# EAGLE design attenumixer (EAGLE 7.7.0)
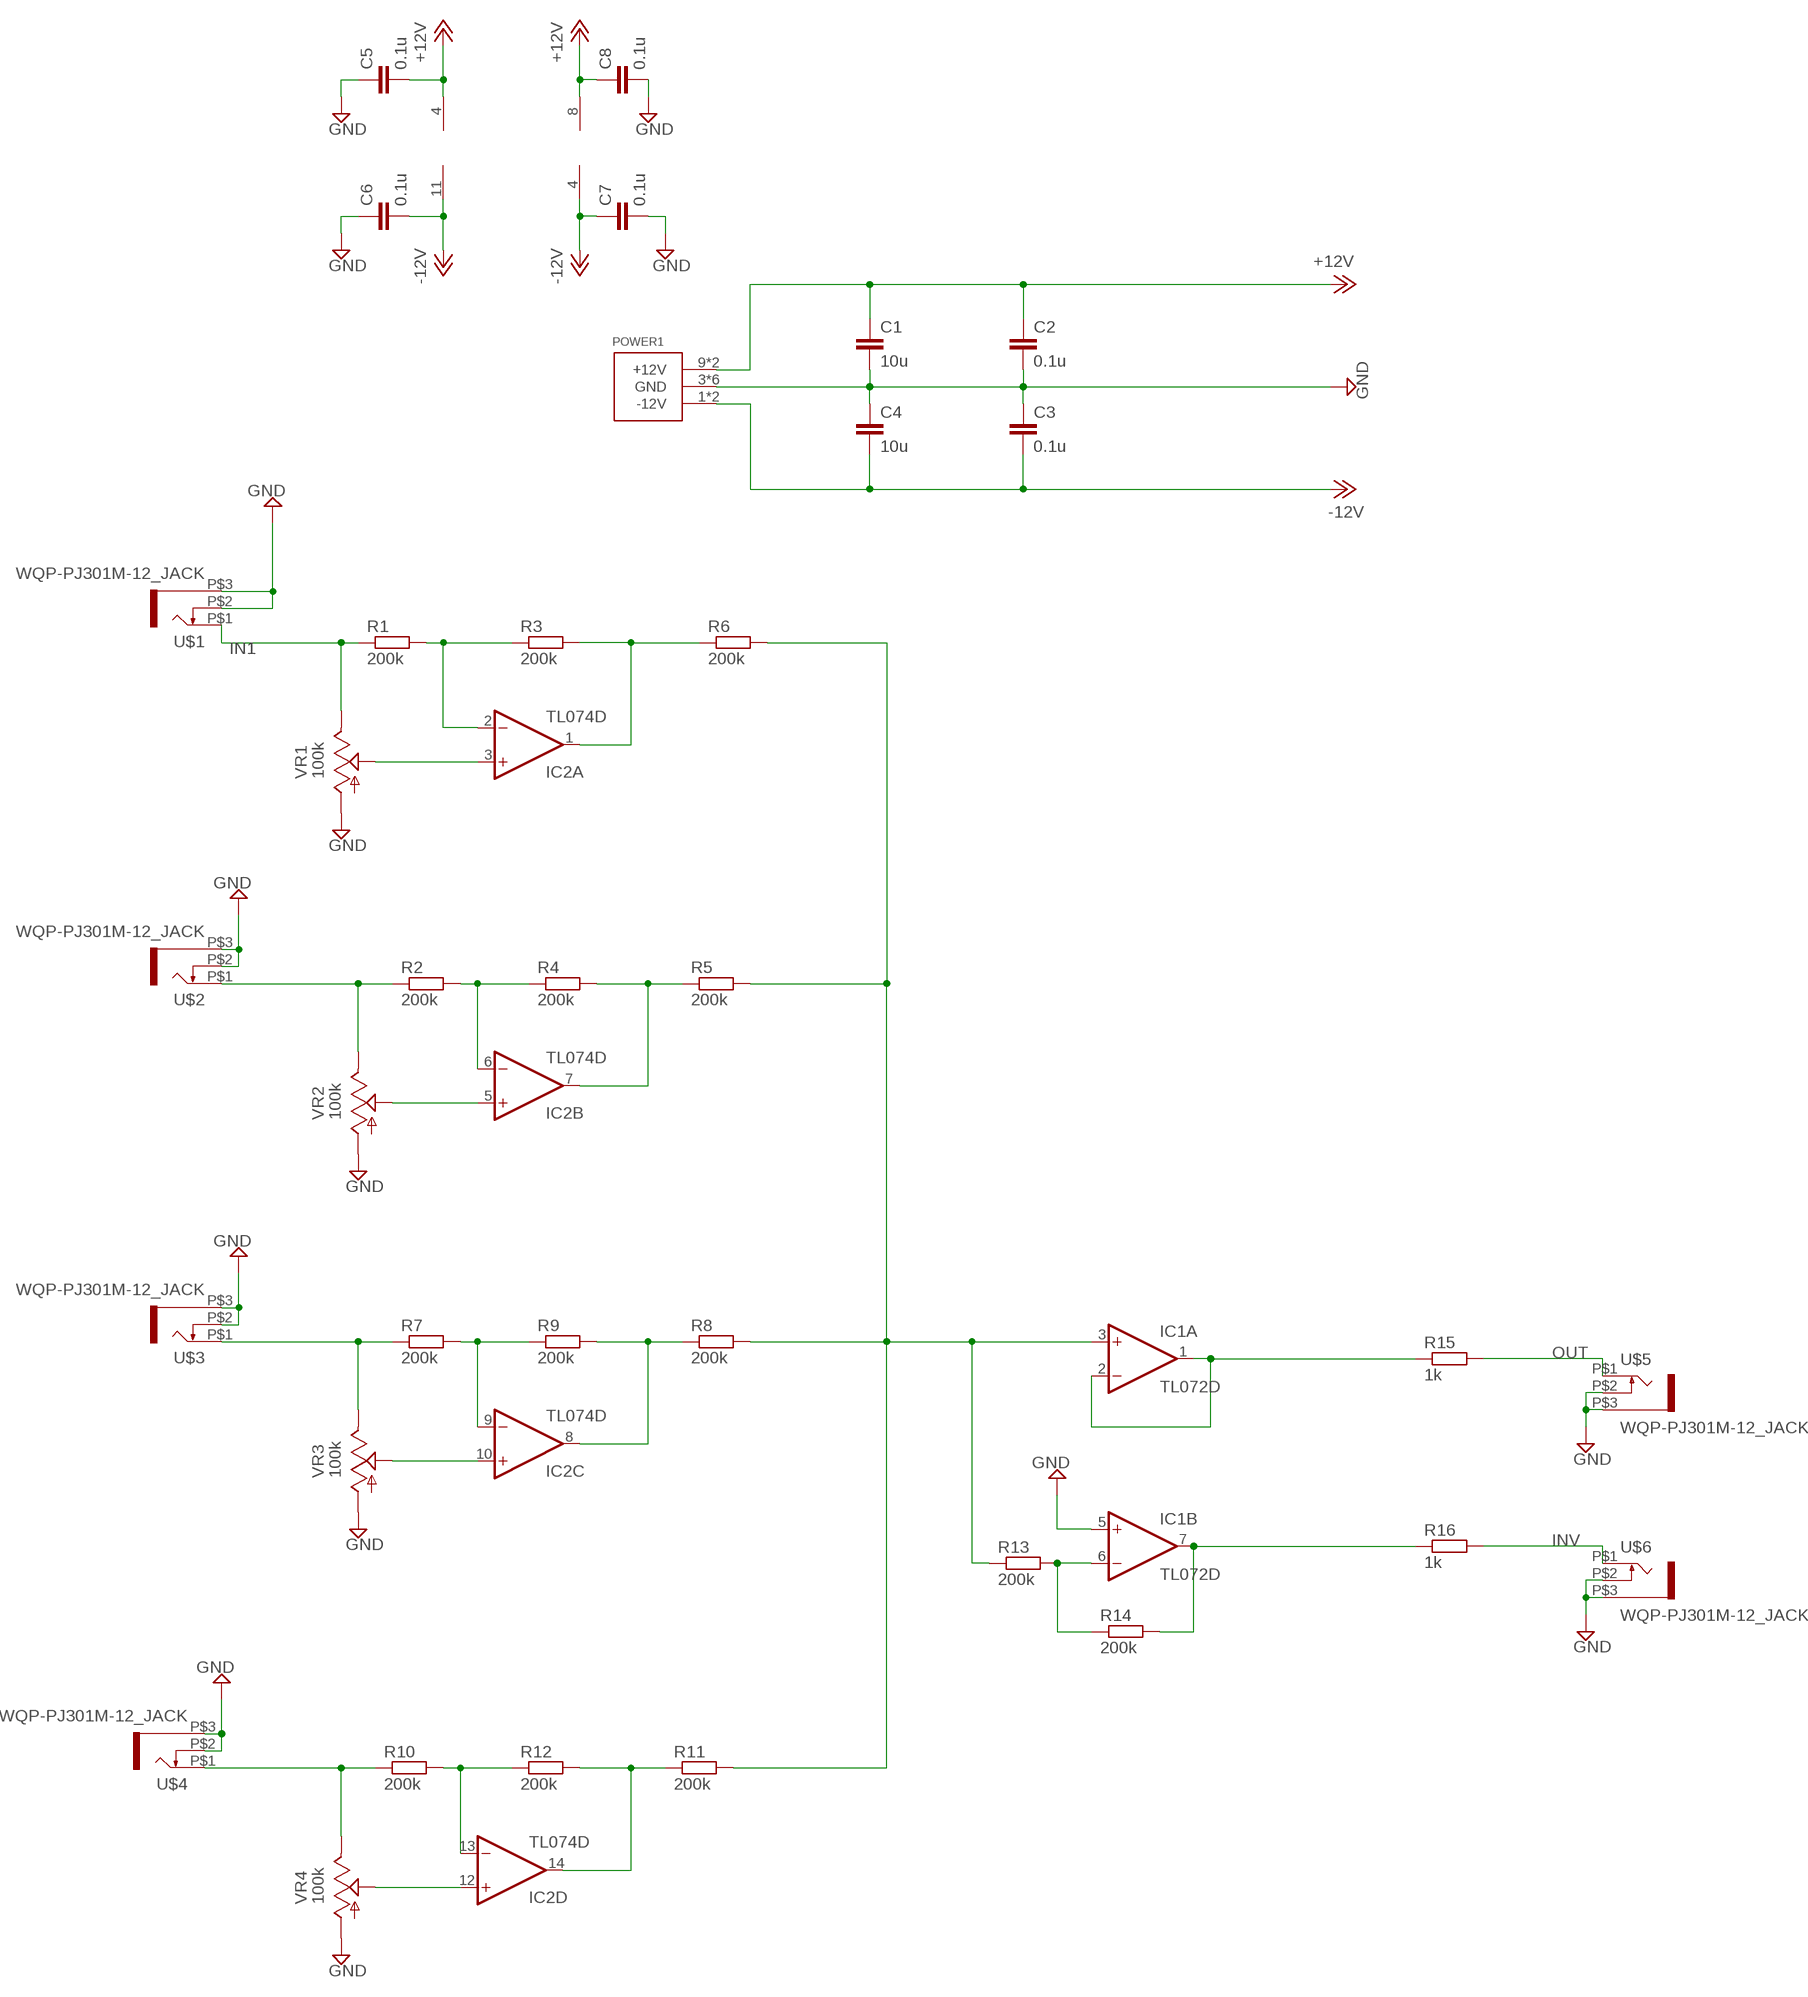
[diagram p0: schematic, sheet 1]

## Parts
C1  10u  C-EUC0805  [C0805]
C2  0.1u  C-EUC0805  [C0805]
C3  0.1u  C-EUC0805  [C0805]
C4  10u  C-EUC0805  [C0805]
C5  0.1u  C-EUC0805  [C0805]
C6  0.1u  C-EUC0805  [C0805]
C7  0.1u  C-EUC0805  [C0805]
C8  0.1u  C-EUC0805  [C0805]
IC1  TL072D  [SO08]
IC2  TL074D  [SO14]
POWER1  POWER_SIMPLE10  [POWER_10]
R1  200k  R-EU_R0805  [R0805]
R2  200k  R-EU_R0805  [R0805]
R3  200k  R-EU_R0805  [R0805]
R4  200k  R-EU_R0805  [R0805]
R5  200k  R-EU_R0805  [R0805]
R6  200k  R-EU_R0805  [R0805]
R7  200k  R-EU_R0805  [R0805]
R8  200k  R-EU_R0805  [R0805]
R9  200k  R-EU_R0805  [R0805]
R10  200k  R-EU_R0805  [R0805]
R11  200k  R-EU_R0805  [R0805]
R12  200k  R-EU_R0805  [R0805]
R13  200k  R-EU_R0805  [R0805]
R14  200k  R-EU_R0805  [R0805]
R15  1k  R-EU_R0805  [R0805]
R16  1k  R-EU_R0805  [R0805]
U$1  WQP-PJ301M-12_JACK  [WQP-PJ301M-12_JACK]
U$2  WQP-PJ301M-12_JACK  [WQP-PJ301M-12_JACK]
U$3  WQP-PJ301M-12_JACK  [WQP-PJ301M-12_JACK]
U$4  WQP-PJ301M-12_JACK  [WQP-PJ301M-12_JACK]
U$5  WQP-PJ301M-12_JACK  [WQP-PJ301M-12_JACK]
U$6  WQP-PJ301M-12_JACK  [WQP-PJ301M-12_JACK]
VR1  100k  9MM_SNAP-IN_POT_  [9MM_SNAP-IN_POT]
VR2  100k  9MM_SNAP-IN_POT_  [9MM_SNAP-IN_POT]
VR3  100k  9MM_SNAP-IN_POT_  [9MM_SNAP-IN_POT]
VR4  100k  9MM_SNAP-IN_POT_  [9MM_SNAP-IN_POT]

## Nets
+12V: C1.1 C2.1 C5.2 C8.1 IC1.8(P:V+) IC2.4(P:V+) POWER1.9(+12V) POWER1.10(+12V)
-12V: C3.2 C4.2 C6.2 C7.1 IC1.4(P:V-) IC2.11(P:V-) POWER1.1(-12V) POWER1.2(-12V)
GND: C1.2 C2.2 C3.1 C4.1 C5.1 C6.1 C7.2 C8.2 IC1.5(B:+IN) POWER1.3(GND) POWER1.4(GND) POWER1.5(GND) POWER1.6(GND) POWER1.7(GND) POWER1.8(GND) U$1.P$2 U$1.P$3 U$2.P$2 U$2.P$3 U$3.P$2 U$3.P$3 U$4.P$2 U$4.P$3 U$5.P$2 U$5.P$3 U$6.P$2 U$6.P$3 VR1.1(A) VR2.1(A) VR3.1(A) VR4.1(A)
IN1: R1.1 U$1.P$1 VR1.3(E)
INV: R16.2 U$6.P$1
N$1: IC2.3(A:+IN) VR1.2(S)
N$2: IC2.5(B:+IN) VR2.2(S)
N$3: IC2.7(B:OUT) R4.2 R5.1
N$4: R2.1 U$2.P$1 VR2.3(E)
N$5: IC2.1(A:OUT) R3.2 R6.1
N$6: IC2.2(A:-IN) R1.2 R3.1
N$7: IC2.10(C:+IN) VR3.2(S)
N$8: IC2.6(B:-IN) R2.2 R4.1
N$9: IC1.1(A:OUT) IC1.2(A:-IN) R15.1
N$11: IC2.8(C:OUT) R8.1 R9.2
N$12: R7.1 U$3.P$1 VR3.3(E)
N$13: IC2.9(C:-IN) R7.2 R9.1
N$14: IC1.7(B:OUT) R14.2 R16.1
N$15: IC2.12(D:+IN) VR4.2(S)
N$16: IC2.14(D:OUT) R11.1 R12.2
N$17: R10.1 U$4.P$1 VR4.3(E)
N$18: IC2.13(D:-IN) R10.2 R12.1
N$19: IC1.3(A:+IN) R5.2 R6.2 R8.2 R11.2 R13.1
N$20: IC1.6(B:-IN) R13.2 R14.1
OUT: R15.2 U$5.P$1

## Library data of the parts
C1-C8 = rcl:C-EU: CAPACITOR, European symbol
IC1 = linear:TL072: OP AMP
IC2 = linear:TL074: OP AMP
POWER1 = eurorack:POWER_SIMPLE
R1-R16 = rcl:R-EU_: RESISTOR, European symbol
U$1-U$6 = thonkiconn:WQP-PJ301M-12_JACK
VR1-VR4 = MusicThingModular:9MM_SNAP-IN_POT: 9mm vertical snap-in pot, Alpha / Panasonic style

## Board
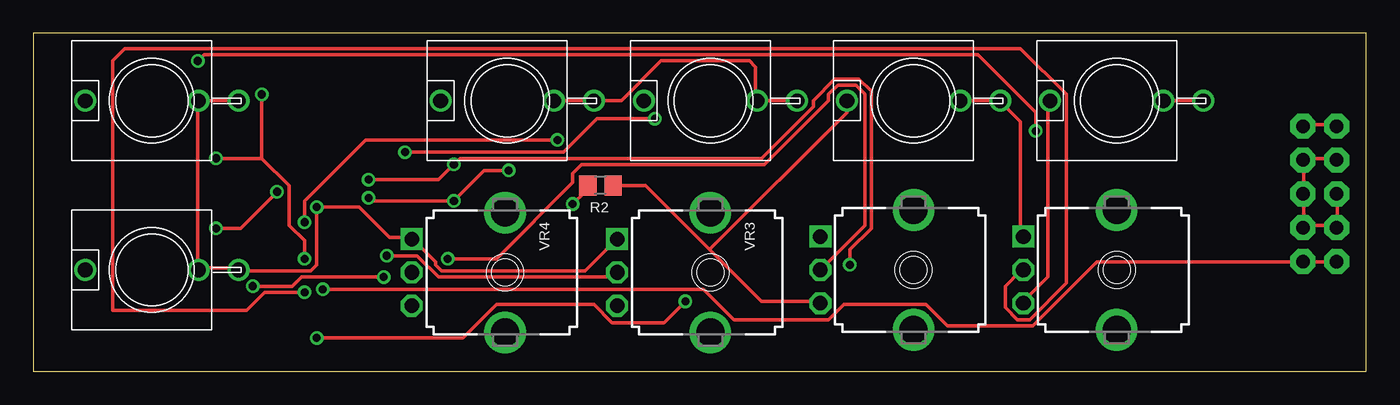
[diagram p1: board, top side]
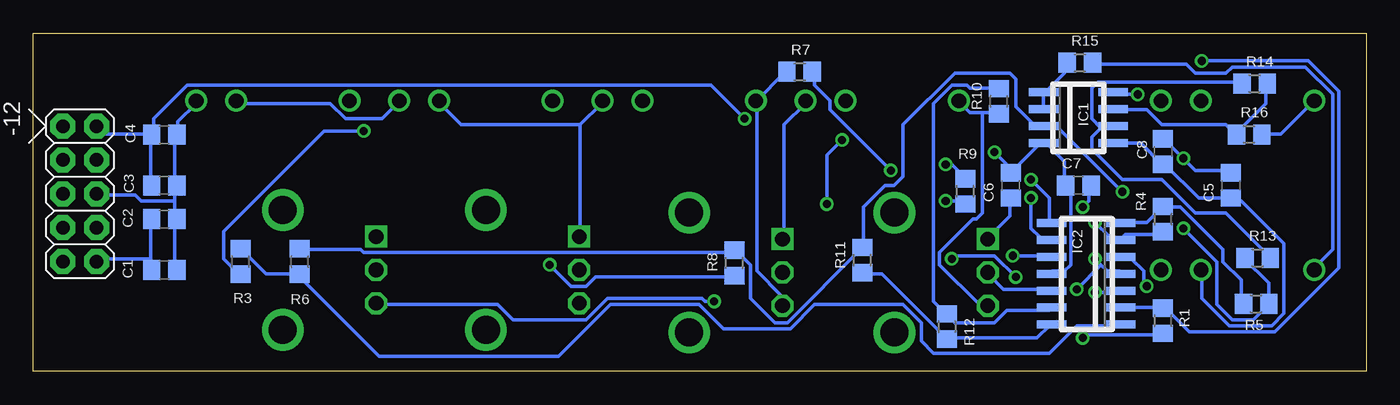
[diagram p2: board, bottom side, seen from below]

Size 100 x 25.39 mm. Coordinates in mm from the lower left corner, seen from the top.
Outline: 0,0 100,0 100,25.39 0,25.39 0,0
Copper layers (1*16): Top 0.035mm / dielectric 1.5mm / Bottom 0.035mm
Design rules "default": minimum track width 10mil, minimum drill 24mil, track to track 8mil, track to pad 8mil, pad to pad 8mil, via to via 8mil, smd to smd 8mil, copper to edge 40mil, drill to drill 8mil, minimum pad ring 10mil, minimum via ring 8mil, stop-mask expansion 4mil, vias tented up to drill 0mil, thermal gap 10mil

### Footprints (pad centres in the part's own frame; a part is rotated, then mirrored left to right if it is on the bottom)
C0805 = smd 1.3 x 1.5: 1 -0.95,0; 2 0.95,0
SO08 = smd 0.6 x 2.2: 1 -1.905,-2.6; 2 -0.635,-2.6; 3 0.635,-2.6; 4 1.905,-2.6; 5 1.905,2.6; 6 0.635,2.6; 7 -0.635,2.6; 8 -1.905,2.6
SO14 = smd 0.6 x 2.2: 1 -3.81,-2.6; 2 -2.54,-2.6; 3 -1.27,-2.6; 4 0,-2.6; 5 1.27,-2.6; 6 2.54,-2.6; 7 3.81,-2.6; 8 3.81,2.6; 9 2.54,2.6; 10 1.27,2.6; 11 0,2.6; 12 -1.27,2.6; 13 -2.54,2.6; 14 -3.81,2.6
POWER_10 = drill 1.016 pad 1.88 octagon: 1 -5.08,-1.27; 2 -5.08,1.27; 3 -2.54,-1.27; 4 -2.54,1.27; 5 0,-1.27; 6 0,1.27; 7 2.54,-1.27; 8 2.54,1.27; 9 5.08,-1.27; 10 5.08,1.27
R0805 = smd 1.3 x 1.5: 1 -0.95,0; 2 0.95,0
WQP-PJ301M-12_JACK = drill 1.1: P$1 0,5; P$2 0,-3.5; P$3 0,-6.5
9MM_SNAP-IN_POT = drill 1.1 square: 1 -2.5,-7 | drill 1.1 octagon: 2 0,-7; 3 2.5,-7 | drill 2.1 pad 2.794: CHASSIS1 -4.5,0; CHASSIS2 4.5,0

### Placement (x,y rotation side)
C1  90.17,7.62 0 bottom
C2  90.17,11.43 0 bottom
C3  90.17,13.97 180 bottom
C4  90.17,17.78 180 bottom
C5  10.16,13.97 90 bottom
C6  26.67,13.97 90 bottom
C7  21.59,13.97 0 bottom
C8  15.24,16.51 270 bottom
IC1  21.59,19.05 270 bottom
IC2  21.01,7.33 90 bottom
POWER1  96.52,13.34 270 bottom
R1  15.24,3.81 90 bottom
R2  42.55,13.97 180 top
R3  84.45,8.26 90 bottom
R4  15.24,11.43 90 bottom
R5  8.26,5.08 0 bottom
R6  80.01,8.26 90 bottom
R7  42.51,22.5 0 bottom
R8  47.4,8.15 90 bottom
R9  30.07,13.53 90 bottom
R10  27.55,20.28 90 bottom
R11  37.81,8.36 90 bottom
R12  31.46,3.37 270 bottom
R13  8.15,8.53 0 bottom
R14  8.36,21.61 0 bottom
R15  21.48,23.18 0 bottom
R16  8.78,17.8 0 bottom
U$1  81.28,20.32 90 top
U$2  66.04,20.32 90 top
U$3  50.8,20.32 90 top
U$4  35.56,20.32 90 top
U$5  8.89,7.62 90 top
U$6  8.89,20.32 90 top
VR1  81.28,7.62 270 top
VR2  66.04,7.62 270 top
VR3  50.8,7.43 270 top
VR4  35.39,7.43 270 top

### Tracks (layer width: path | path; a pad name or v marks a point on that pad's centre or on a via)
+12V  (via drill 0.61)
  Top 0.254: POWER1.9 97.61,8.23 95.33,8.23 POWER1.10 95.1,8.23 79.78,8.23 74.98,3.43 68.58,3.43 66.98,5.03 60.81,5.03 59.66,3.89 52.58,3.89 50.29,6.17 v21.72,6.17 | v20.34,8.46 20.34,9.83 19.2,10.97 19.2,13.95 17.14,16 | v13.72,16 17.14,16 | 17.14,16 v17.14,20.8
  Bottom 0.254: 91.21,8.46 91.21,11.43 C2.1 | 91.21,8.46 91.21,7.77 C1.1 | 91.21,8.46 95.1,8.46 POWER1.10 | C5.2 10.29,15.09 12.8,15.09 v13.72,16 15.09,17.37 C8.1 | v20.34,8.46 19.89,8 | 19.89,8 19.43,7.54 18.52,7.54 IC2.4 | v17.14,20.8 18.97,20.8 IC1.8 | 19.89,8 v21.72,6.17
-12V  (via drill 0.61)
  Top 0.254: POWER1.1 97.61,18.52 95.33,18.52 POWER1.2 | v46.63,18.97 42.29,18.97 39.78,16.46 v27.89,16.46
  Bottom 0.254: C3.2 91.21,14.17 91.21,17.6 C4.2 | C4.2 91.21,17.83 94.64,17.83 95.1,18.29 POWER1.2 | 26.52,15.09 24.46,17.14 IC1.4 24,17.14 22.63,15.77 22.63,14.17 C7.1 22.4,13.95 22.17,13.72 22.17,8 22.63,7.54 23.55,7.54 IC2.11 | v46.63,18.97 49.15,21.49 88.47,21.49 90.98,18.97 90.98,17.83 C4.2 | 26.52,15.09 v27.89,16.46 | 26.52,15.09 C6.2
GND  (via drill 0.61)
  Top 0.254: U$6.P$3 15.32,20.34 12.57,20.34 U$6.P$2 12.34,20.12 12.34,7.77 U$5.P$2 12.57,7.77 15.32,7.77 U$5.P$3 15.54,7.54 20.8,7.54 21.26,8 v21.26,12.34 24.46,12.34 26.75,10.06 28.35,10.06 VR4.1 28.57,9.83 30.18,8.23 30.18,8 30.63,7.54 41.38,7.54 43.66,9.83 VR3.1 | POWER1.3 97.61,16 95.33,16 POWER1.4 95.33,15.77 95.33,13.49 POWER1.6 95.33,13.26 95.33,10.97 | POWER1.5 97.84,13.26 97.84,10.97 POWER1.7 97.61,10.97 95.33,10.97 | 95.33,10.97 POWER1.8 | U$1.P$2 84.81,20.34 87.55,20.34 U$1.P$3 | U$4.P$2 39.09,20.34 41.83,20.34 U$4.P$3 42.06,20.34 44.12,20.34 47.09,23.32 53.72,23.32 54.18,22.86 54.18,20.34 U$3.P$2 54.41,20.34 57.15,20.34 U$3.P$3 | VR1.1 74.07,10.29 74.07,18.75 72.69,20.12 U$2.P$3 72.47,20.34 69.72,20.34 U$2.P$2
  Bottom 0.254: IC1.5 16.92,17.14 15.32,15.54 C8.2 15.09,15.54 12.57,13.03 10.29,13.03 C5.1 10.06,12.8 9.37,12.8 6.17,9.6 6.17,4.34 7.09,3.43 10.29,3.43 12.34,5.49 12.34,7.54 U$5.P$2 | v21.26,12.34 20.8,12.8 20.8,13.95 C7.2 | C6.1 26.75,12.8 26.75,11.66 28.35,10.06 VR4.1 | 89.38,11.43 89.38,7.77 C1.2 | 89.38,11.43 89.38,12.8 | 89.38,12.8 89.38,13.95 C3.1 89.38,14.17 89.38,17.6 C4.1 89.15,17.83 89.15,18.75 87.78,20.12 U$1.P$3 | 89.38,11.43 C2.2 | 89.38,12.8 91.9,12.8 92.35,13.26 95.1,13.26 POWER1.6 | VR3.1 43.66,10.06 43.66,18.52 42.06,20.12 U$4.P$3 | 58.98,18.52 58.98,10.29 VR2.1 | 58.98,18.52 57.38,20.12 U$3.P$3 | 58.98,18.52 67.89,18.52 69.49,20.12 U$2.P$2 | U$1.P$2 84.58,20.12 77.72,20.12 76.58,18.97 73.84,18.97 72.69,20.12 U$2.P$3
IN1  (via drill 0.61)
  Top 0.254: v21.26,2.52 32.23,2.52 34.75,5.03 42.06,5.03 43.43,3.66 47.32,3.66 v48.92,5.26 | U$1.P$1 76.12,20.12 76.12,7.09 74.3,5.26 VR1.3
  Bottom 0.254: v21.26,2.52 21.03,2.74 15.32,2.74 R1.1 | v48.92,5.26 49.61,5.26 49.84,5.49 56.92,5.49 58.52,3.89 64.01,3.89 65.15,5.03 74.07,5.03 VR1.3
INV
  Bottom 0.254: R16.2 7.77,17.83 6.4,17.83 4.12,20.12 U$6.P$1
N$1  (via drill 0.61)
  Top 0.254: v20.34,5.94 17.37,5.94 16,4.57 5.94,4.57 5.94,23.32 6.86,24.23 74.07,24.23 77.5,20.8 77.5,6.63 74.75,3.89 73.84,3.89 72.92,4.8 72.92,6.4 74.07,7.54 VR1.2
  Bottom 0.254: v20.34,5.94 18.52,5.94 IC2.3
N$2  (via drill 0.61)
  Top 0.254: v16.46,6.4 19.43,6.4 20.12,7.09 v26.29,7.09 | v31.09,8.46 34.75,8.46 40.46,14.17 40.46,14.86 41.15,15.54 54.86,15.54 59.66,20.34 59.66,20.8 60.35,21.49 61.72,21.49 62.41,20.8 62.41,10.97 59.21,7.77 VR2.2
  Bottom 0.254: v16.46,6.4 16.69,6.63 16.69,7.54 17.6,8.46 18.29,8.46 IC2.5 | v26.29,7.09 27.89,8.69 30.86,8.69 v31.09,8.46
N$3
  Bottom 0.254: R5.1 9.37,5.26 9.37,6.86 10.74,8.23 10.74,9.14 13.95,12.34 15.09,12.34 R4.2 15.32,12.34 16.46,11.2 18.29,11.2 IC2.7
N$4
  Top 0.254: 50.75,9.14 54.63,5.26 58.98,5.26 VR2.3 | 50.75,9.14 45.95,13.95 43.66,13.95 R2.1 | 50.75,9.14 61.04,19.43 61.04,20.12 U$2.P$1
N$5
  Bottom 0.254: R3.2 84.35,9.14 82.53,7.32 R6.1 80.01,7.09 74.07,1.14 60.58,1.14 56.69,5.03 50.06,5.03 48.23,3.2 43.2,3.2 41.38,5.03 34.75,5.03 33.38,3.66 33.38,2.29 32.46,1.37 23.77,1.37 21.72,3.43 18.52,3.43 IC2.1
N$6  (via drill 0.61)
  Top 0.254: v75.21,18.06 75.21,19.43 70.87,23.77 12.8,23.77 v12.34,23.32
  Bottom 0.254: IC2.2 18.29,4.8 15.32,4.8 R1.2 15.09,4.8 13.26,2.97 6.86,2.97 2.06,7.77 2.06,21.03 4.34,23.32 v12.34,23.32 | v75.21,18.06 78.18,18.06 85.72,10.52 85.72,8.46 84.58,7.32 R3.1
N$7  (via drill 0.61)
  Top 0.254: v26.52,8.69 28.8,8.69 30.4,7.09 43.43,7.09 43.66,7.32 VR3.2
  Bottom 0.254: v26.52,8.69 23.77,8.69 IC2.10
N$8  (via drill 0.61)
  Top 0.254: v40.46,12.57 41.38,13.49 41.38,13.95 R2.2 | v39.32,17.37 24.92,17.37 20.34,12.8 v20.34,11.2
  Bottom 0.254: R4.1 15.32,10.29 18.06,10.29 18.29,10.06 IC2.6 18.52,10.06 19.2,10.06 v20.34,11.2 | v40.46,12.57 40.46,16.23 v39.32,17.37
N$9
  Bottom 0.254: R15.1 22.63,23.09 22.63,22.4 24,21.03 IC1.1 24.23,20.8 24.23,19.89 IC1.2
N$11  (via drill 0.61)
  Top 0.254: v61.27,8 61.27,9.14 62.87,10.74 62.87,21.03 61.95,21.95 60.12,21.95 58.52,20.34 58.52,19.89 54.63,16 32,16 v31.55,15.54 30.4,14.4 v25.15,14.4
  Bottom 0.254: v61.27,8 59.66,6.4 58.52,6.4 57.84,7.09 47.55,7.09 R8.1 | v31.55,15.54 31.09,15.54 30.18,14.63 R9.2 | v25.15,14.4 23.77,13.03 23.77,11.2 IC2.8
N$12
  Bottom 0.254: R7.1 43.66,22.4 45.72,20.34 U$3.P$1 45.72,20.12 45.72,7.54 43.89,5.71 43.89,5.03 VR3.3
N$13  (via drill 0.61)
  Top 0.254: v25.15,13.03 25.38,12.8 v31.55,12.8 33.83,15.09 v35.66,15.09
  Bottom 0.254: v31.55,12.8 30.18,12.8 R9.1 | v25.15,13.03 25.15,10.74 24.46,10.06 23.77,10.06 IC2.9 | v35.66,15.09 40.23,19.66 40.23,20.34 41.38,21.49 41.38,22.4 R7.2
N$14
  Bottom 0.254: 9.83,17.83 7.54,20.12 7.54,21.49 R14.2 | 9.83,17.83 10.52,18.52 15.32,18.52 16.46,19.66 18.97,19.66 IC1.7 | 9.83,17.83 R16.1
N$15
  Bottom 0.254: IC2.12 23.77,6.17 27.2,6.17 28.35,7.32 VR4.2
N$16
  Bottom 0.254: IC2.14 23.77,3.43 24.69,2.52 31.32,2.52 R12.2 31.55,2.52 36.35,7.32 37.72,7.32 R11.1
N$17
  Bottom 0.254: 28.8,19.43 29.72,19.43 30.4,20.12 U$4.P$1 | 28.8,19.43 27.66,19.43 R10.1 | 28.8,19.43 28.8,11.89 29.26,11.43 29.49,11.43 32,8.91 32,8 29.03,5.03 28.57,5.03 VR4.3
N$18
  Bottom 0.254: R10.2 27.66,21.26 29.72,21.26 29.95,21.49 31.09,21.49 32.46,20.12 32.46,5.26 31.55,4.34 R12.1 31.32,4.12 30.86,3.66 27.89,3.66 26.98,4.57 23.77,4.57 IC2.13
N$19  (via drill 0.61)
  Top 0.254: v13.72,10.74 15.54,10.74 v18.29,13.49
  Bottom 0.254: R13.1 9.14,8.46 7.32,6.63 7.32,5.26 R5.2 7.32,5.03 8.46,3.89 10.06,3.89 11.2,5.03 11.2,8.23 v13.72,10.74 | R6.2 80.01,9.14 75.44,9.14 75.21,8.91 47.55,8.91 R8.2 47.32,9.14 46.18,8 46.18,5.49 44.35,3.66 43.43,3.66 37.95,9.14 R11.2 37.72,9.37 37.72,12.34 36.12,13.95 35.43,13.95 34.75,14.63 34.75,18.52 30.86,22.4 26.75,22.4 26.29,21.95 26.29,19.89 24.92,18.52 24.23,18.52 IC1.3 24,18.29 23.09,18.29 v18.29,13.49
N$20
  Bottom 0.254: 19.89,18.29 20.57,17.6 20.57,16.69 18.29,14.4 15.32,14.4 12.8,11.89 10.52,11.89 7.32,8.69 R13.2 | 19.89,18.29 19.2,18.29 IC1.6 19.89,18.29 | 19.89,18.29 20.57,18.97 20.57,21.26 20.12,21.72 9.37,21.72 R14.1
OUT
  Bottom 0.254: R15.2 20.34,23.09 13.49,23.09 12.8,22.4 10.52,22.4 10.06,22.86 4.57,22.86 2.52,20.8 2.52,9.14 3.89,7.77 U$5.P$1